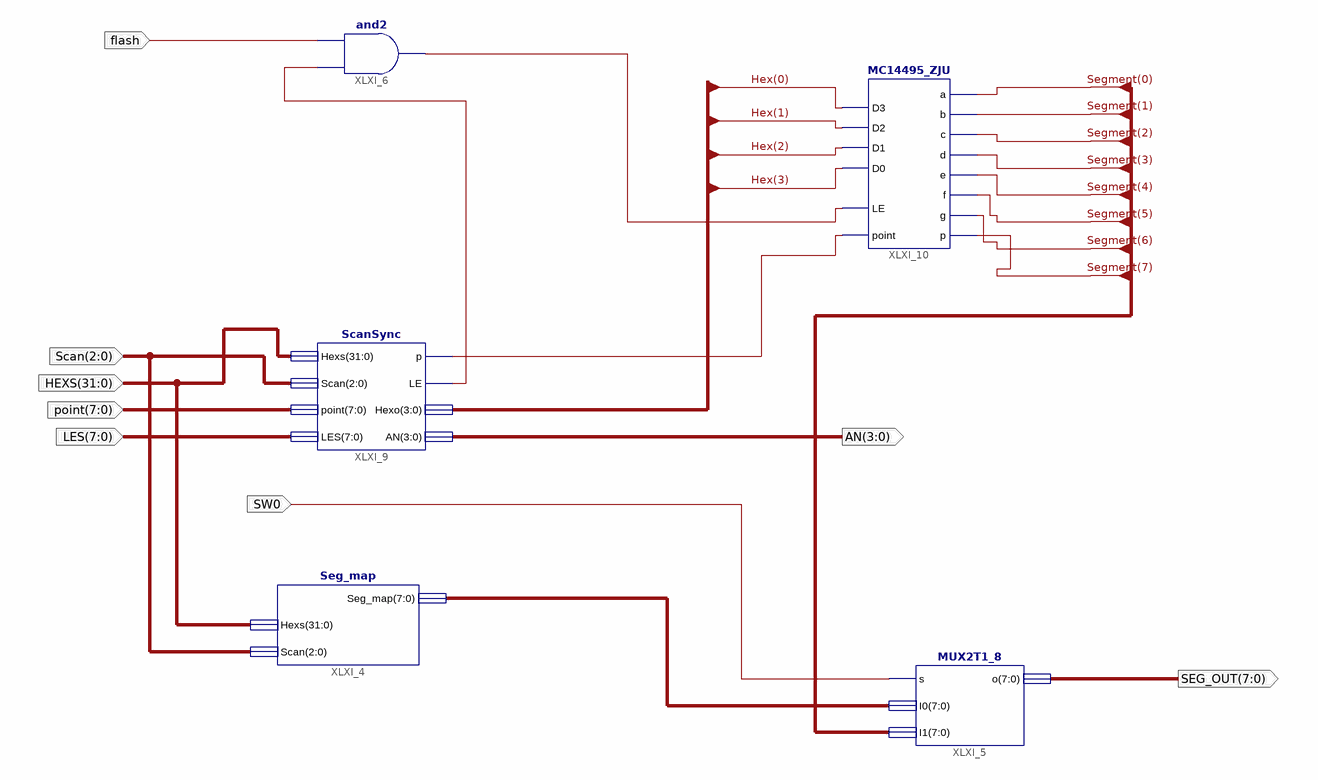
[diagram p0: schematic sheet 1]
// Xilinx ISE schematic DispNum.sch (kintex7) as structural Verilog: 5 symbols, 8 ports
module DispNum (
  input  [31:0] HEXS,
  input  [7:0] LES,
  input  SW0,
  input  [2:0] Scan,
  input  flash,
  input  [7:0] point,
  output [3:0] AN,
  output [7:0] SEG_OUT
);

  wire XLXN_25, XLXN_30, XLXN_32;
  wire [3:0] Hex;
  wire [7:0] Segment, XLXN_19;

  Seg_map XLXI_4 (.Seg_map(XLXN_19), .Hexs(HEXS), .Scan(Scan));
  MUX2T1_8 XLXI_5 (.s(SW0), .I0(XLXN_19), .I1(Segment), .o(SEG_OUT));
  and XLXI_6 (XLXN_32, XLXN_25, flash);
  ScanSync XLXI_9 (.Hexs(HEXS), .Scan(Scan), .point(point), .LES(LES), .p(XLXN_30), .LE(XLXN_25), .Hexo(Hex), .AN(AN));
  MC14495_ZJU XLXI_10 (
    .D0(Hex[3]), .D1(Hex[2]), .D2(Hex[1]), .D3(Hex[0]), .p(Segment[7]), .g(Segment[6]), .f(Segment[5]),
    .e(Segment[4]), .d(Segment[3]), .c(Segment[2]), .b(Segment[1]), .a(Segment[0]), .point(XLXN_30),
    .LE(XLXN_32));
endmodule
